# EAGLE schematic Elektrisch_schema (EAGLE 9.7.0)
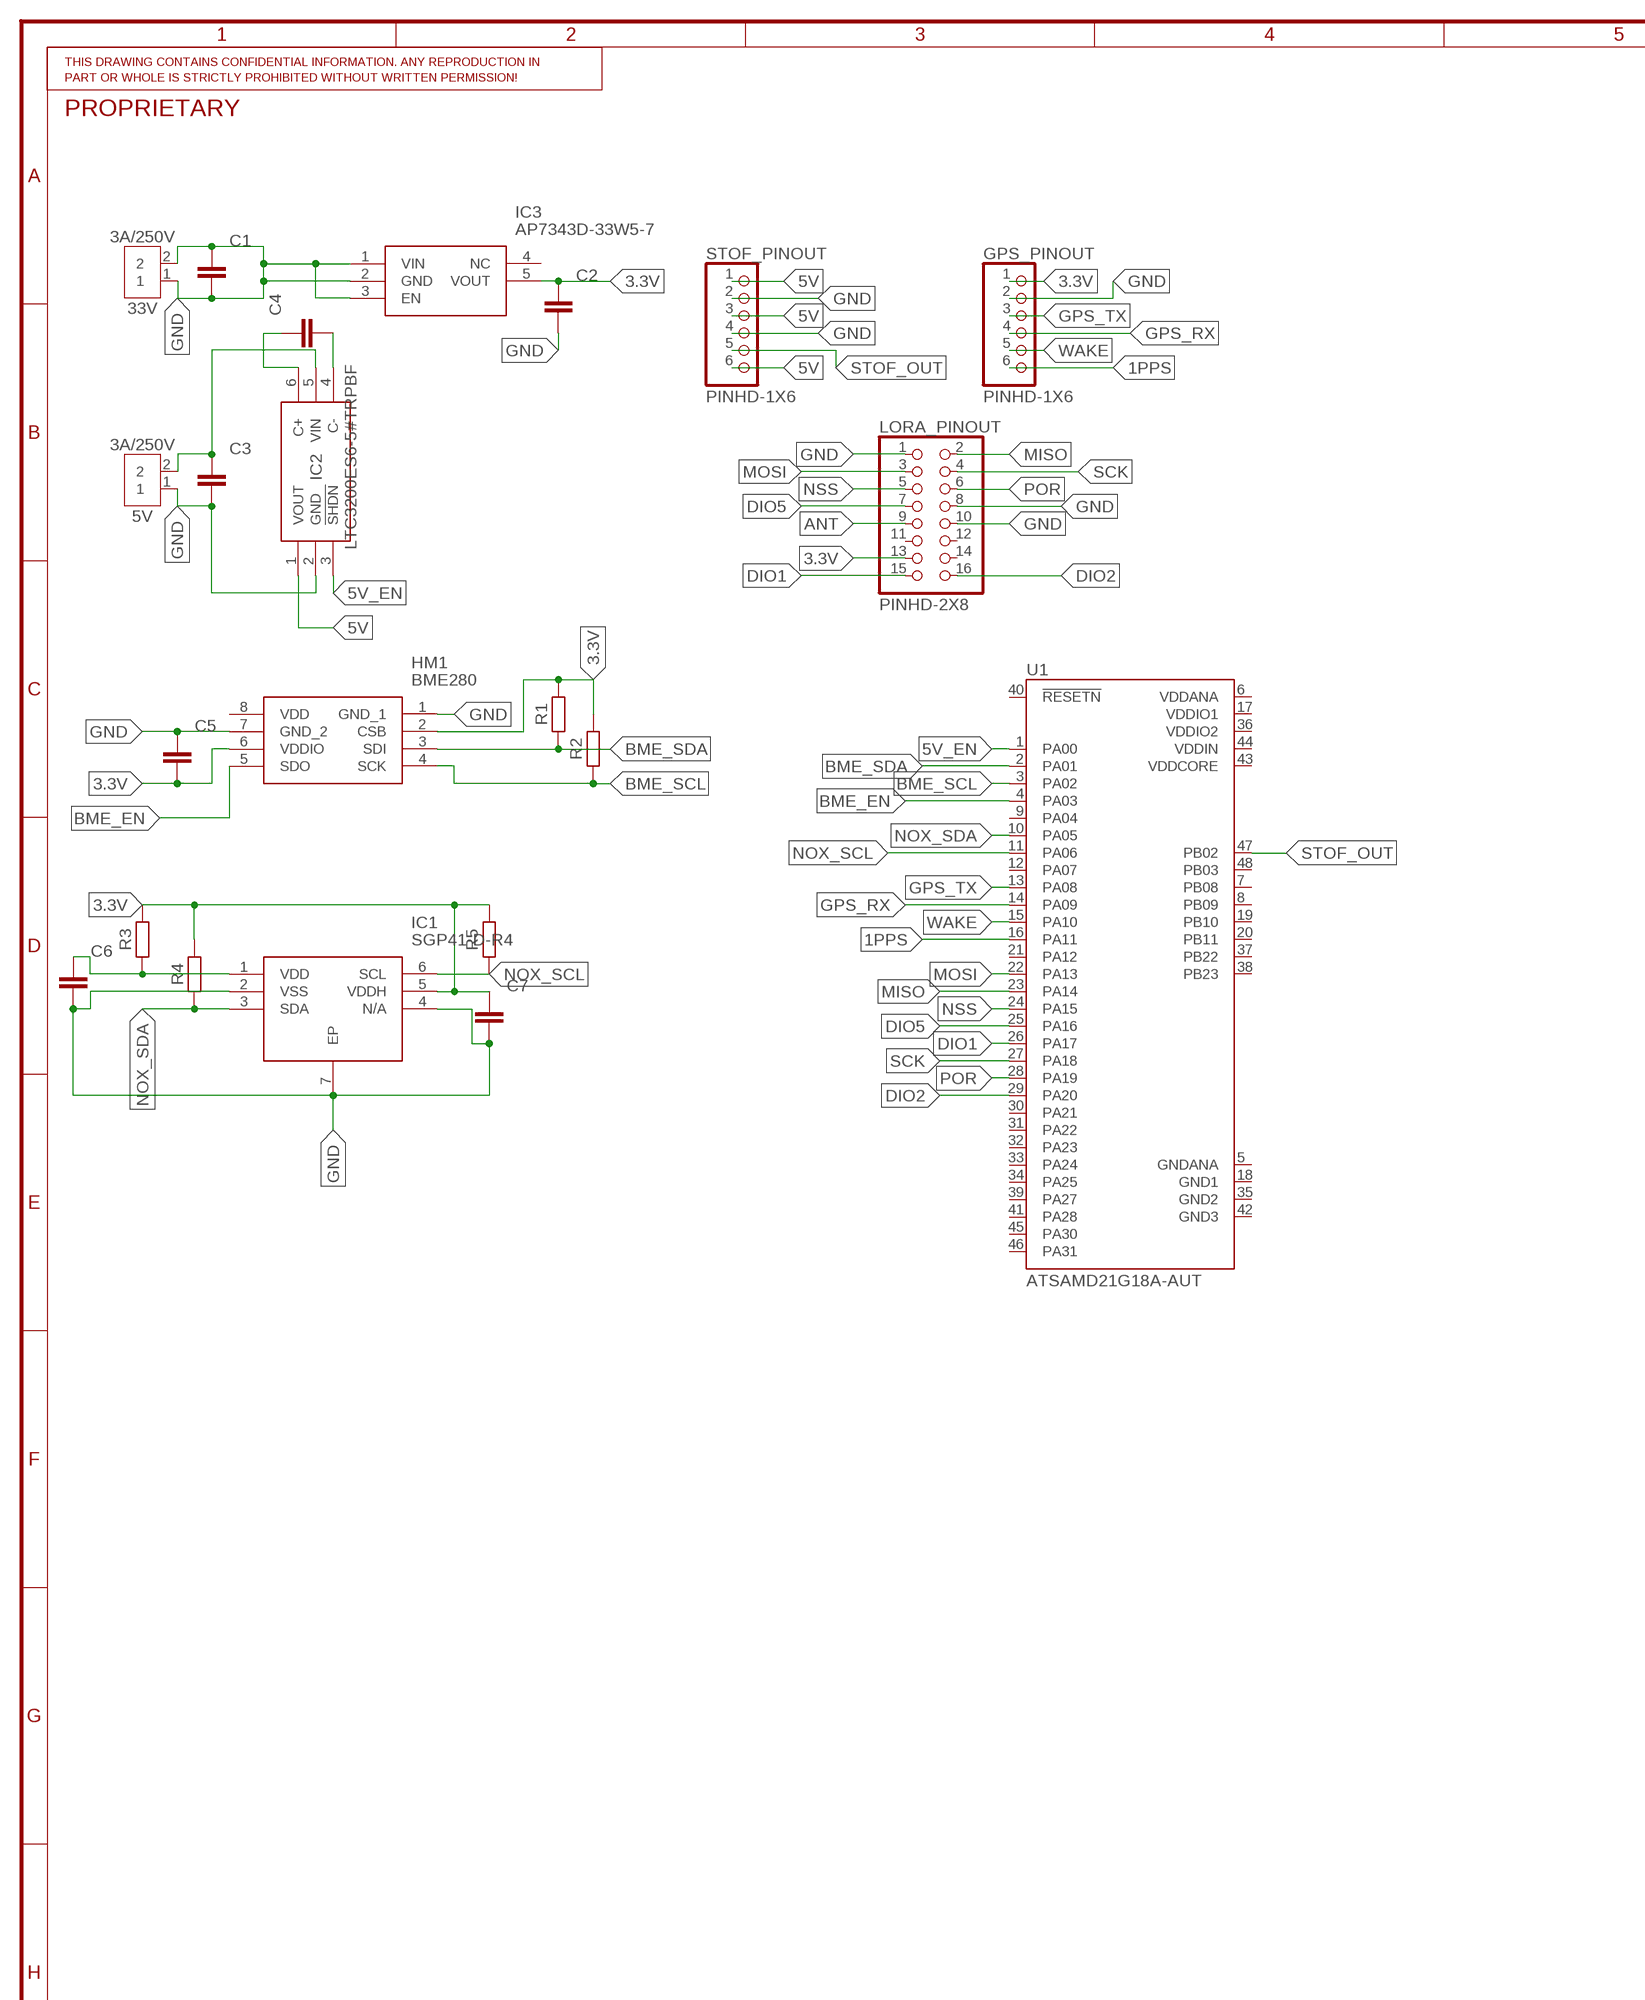
[diagram p0: schematic, sheet 1, part 1 of 2]
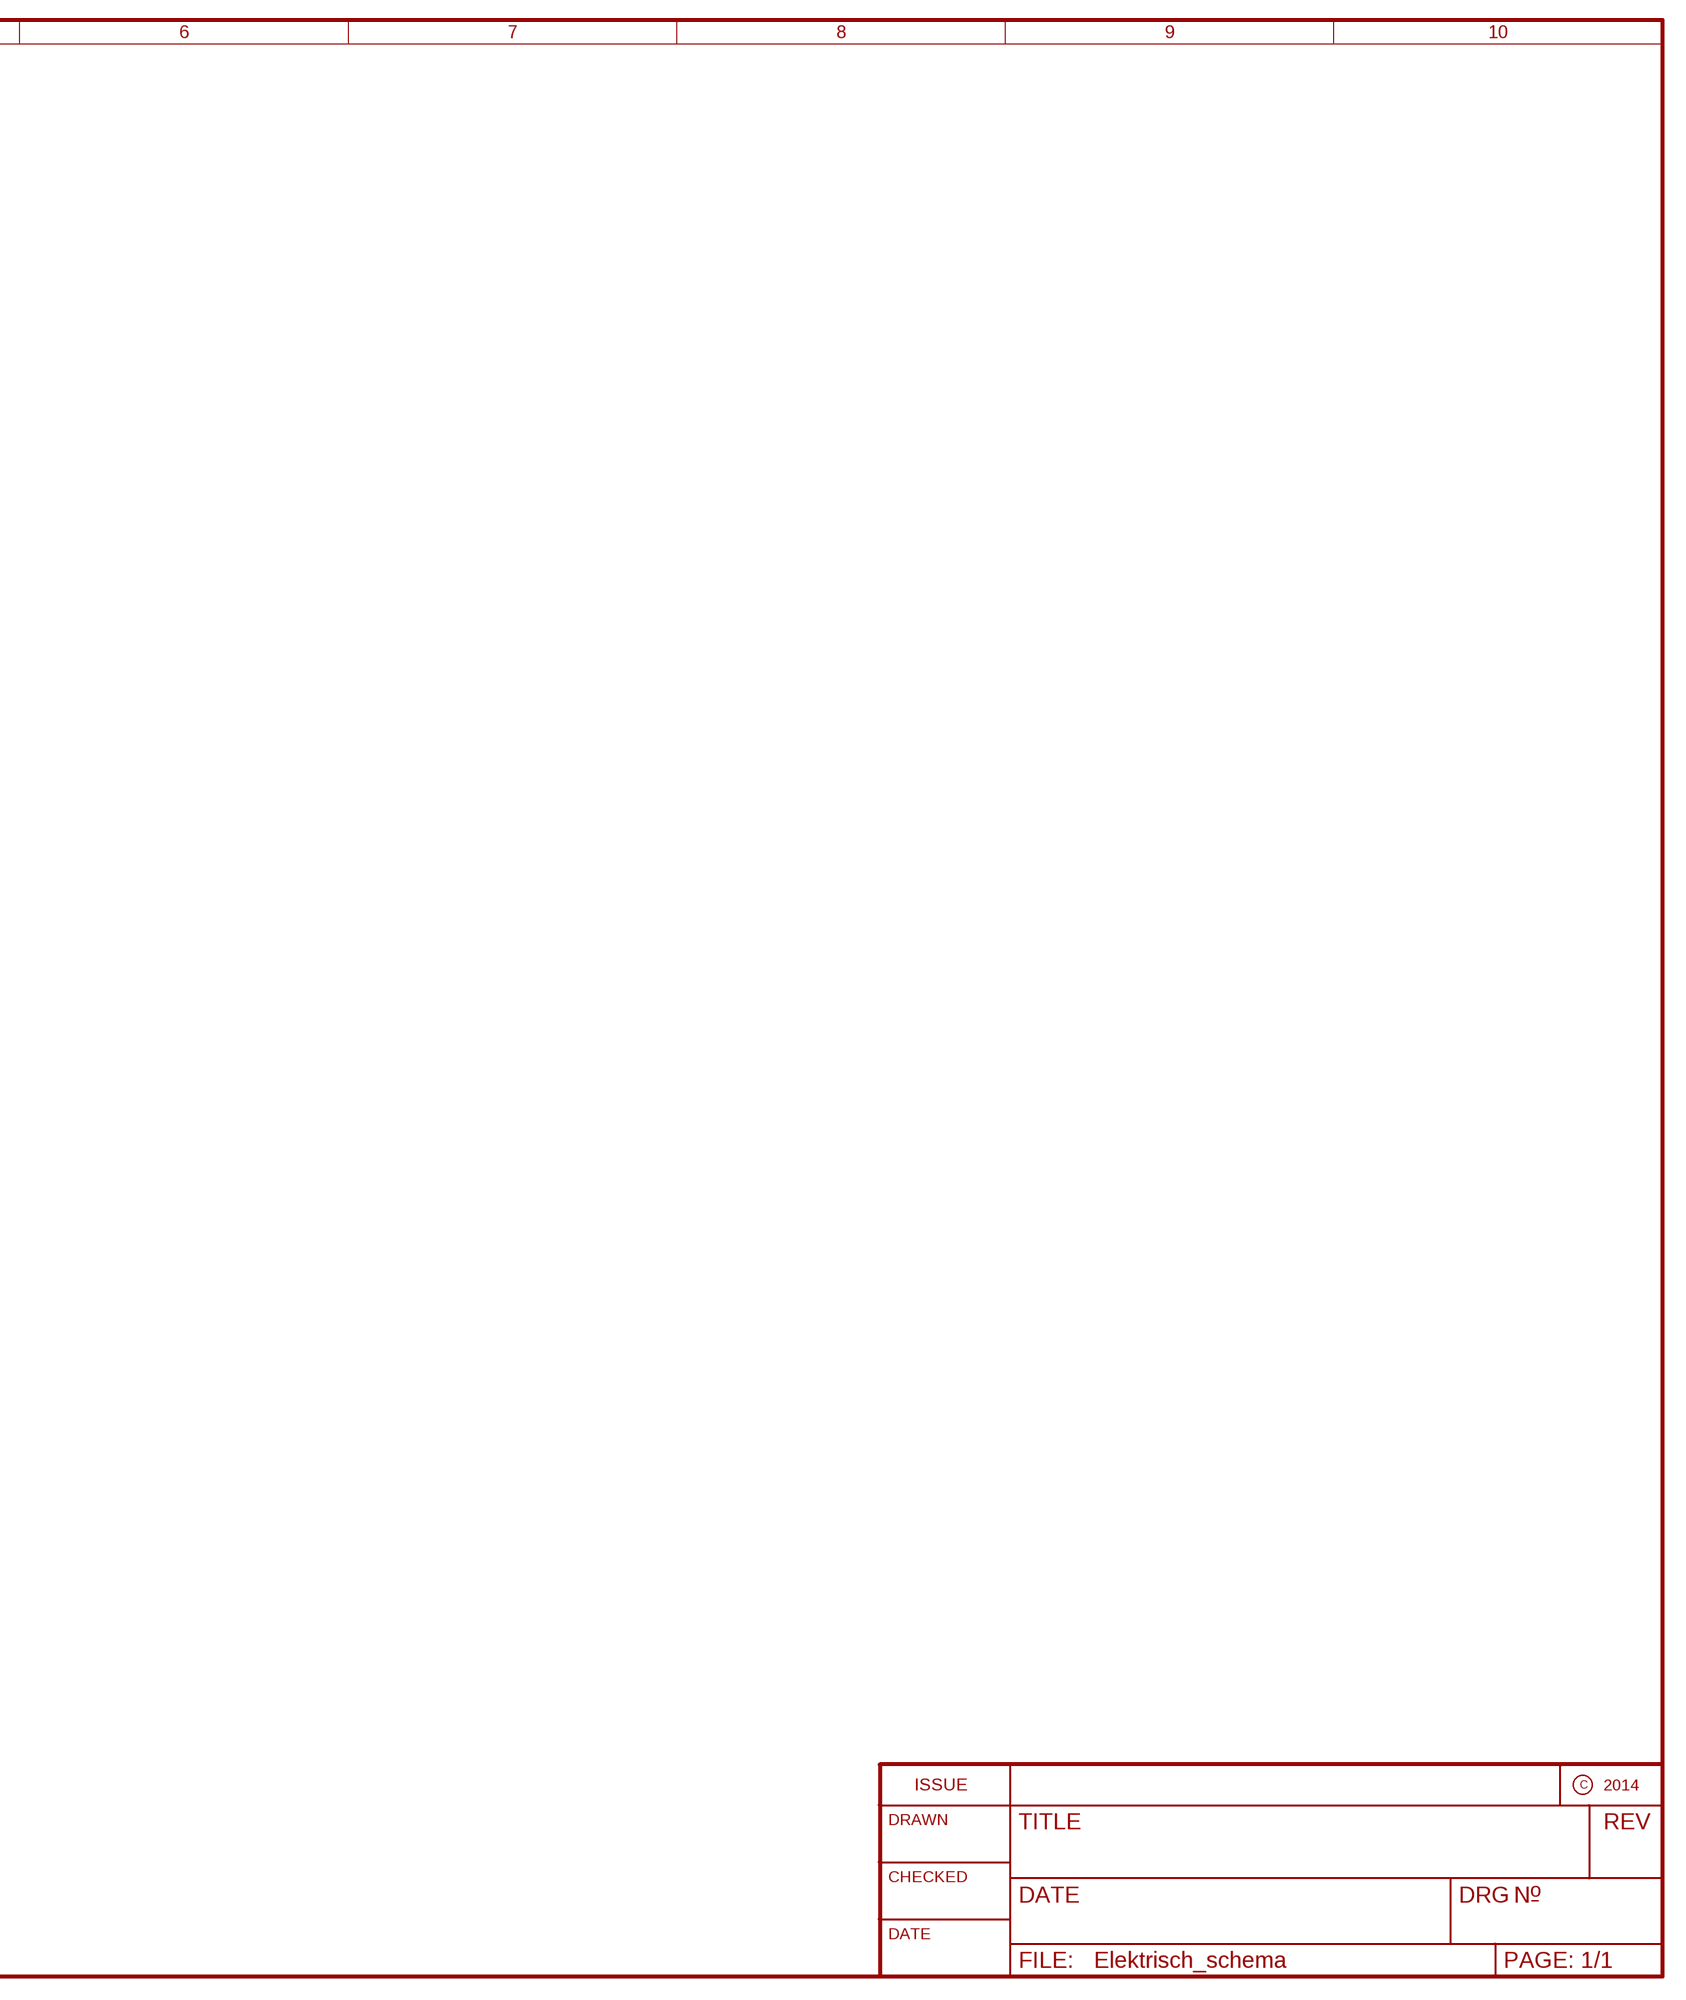
[diagram p1: schematic, sheet 1, part 2 of 2]

## Parts
5V  3A/250V  B2B-XH-A  [B2B-XH-A]
33V  3A/250V  B2B-XH-A  [B2B-XH-A]
C1  C_CHIP-0402(1005-METRIC)  [CAPC1005X60]
C2  C_CHIP-0402(1005-METRIC)  [CAPC1005X60]
C3  C_CHIP-0402(1005-METRIC)  [CAPC1005X60]
C4  C_CHIP-0402(1005-METRIC)  [CAPC1005X60]
C5  C_CHIP-0402(1005-METRIC)  [CAPC1005X60]
C6  C_CHIP-0504(1310-METRIC)  [CAPC1110X102]
C7  C_CHIP-0402(1005-METRIC)  [CAPC1005X60]
GPS_PINOUT  PINHD-1X6  [1X06]
HM1  BME280  [BME280]
IC1  SGP41-D-R4  [SON80P244X244X95-7N]
IC2  LTC3200ES6-5#TRPBF  [SOT95P280X145-6N]
IC3  AP7343D-33W5-7  [SOT95P285X140-5N]
LORA_PINOUT  PINHD-2X8  [2X08]
R1  R_CHIP-0402(1005-METRIC)  [RESC1005X40]
R2  R_CHIP-0402(1005-METRIC)  [RESC1005X40]
R3  R_CHIP-0402(1005-METRIC)  [RESC1005X40]
R4  R_CHIP-0402(1005-METRIC)  [RESC1005X40]
R5  R_CHIP-0402(1005-METRIC)  [RESC1005X40]
STOF_PINOUT  PINHD-1X6  [1X06]
U1  ATSAMD21G18A-AUT  [QFP50P900X900X120-48N]

## Nets
1PPS: GPS_PINOUT.6 U1.16(PA11)
3.3V: C2.1 C5.2 C7.1 GPS_PINOUT.1 HM1.2(CSB) HM1.6(VDDIO) IC1.5(VDDH) IC3.5(VOUT) LORA_PINOUT.13 R1.2 R2.2 R3.2 R4.2 R5.2
5V: IC2.1(VOUT) STOF_PINOUT.1 STOF_PINOUT.3 STOF_PINOUT.6
5V_EN: IC2.3(!SHDN) U1.1(PA00)
ANT: LORA_PINOUT.9
BME_EN: HM1.5(SDO) U1.4(PA03)
BME_SCL: HM1.4(SCK) R2.1 U1.3(PA02)
BME_SDA: HM1.3(SDI) R1.1 U1.2(PA01)
DIO1: LORA_PINOUT.15 U1.26(PA17)
DIO2: LORA_PINOUT.16 U1.29(PA20)
DIO5: LORA_PINOUT.7 U1.25(PA16)
GND: 5V.1 33V.2 C1.1 C1.2 C2.2 C3.2 C5.1 C6.2 C7.2 GPS_PINOUT.2 HM1.1(GND_1) HM1.7(GND_2) IC1.2(VSS) IC1.4(N/A) IC1.7(EP) IC2.2(GND) IC3.1(VIN) IC3.2(GND) IC3.3(EN) LORA_PINOUT.1 LORA_PINOUT.8 LORA_PINOUT.10 STOF_PINOUT.2 STOF_PINOUT.4
GPS_RX: GPS_PINOUT.4 U1.14(PA09)
GPS_TX: GPS_PINOUT.3 U1.13(PA08)
MISO: LORA_PINOUT.2 U1.23(PA14)
MOSI: LORA_PINOUT.3 U1.22(PA13)
N$1: 5V.2 C3.1 IC2.5(VIN)
N$2: 33V.1
N$3: C4.2 IC2.4(C-)
N$4: C4.1 IC2.6(C+)
N$5: C6.1 IC1.1(VDD) R3.1
NOX_SCL: IC1.6(SCL) R5.1 U1.11(PA06)
NOX_SDA: IC1.3(SDA) R4.1 U1.10(PA05)
NSS: LORA_PINOUT.5 U1.24(PA15)
POR: LORA_PINOUT.6 U1.28(PA19)
SCK: LORA_PINOUT.4 U1.27(PA18)
STOF_OUT: STOF_PINOUT.5 U1.47(PB02)
WAKE: GPS_PINOUT.5 U1.15(PA10)
Unconnected: IC3.4(NC) LORA_PINOUT.11 LORA_PINOUT.12 LORA_PINOUT.14 U1.7(PB08) U1.8(PB09) U1.9(PA04) U1.12(PA07) U1.19(PB10) U1.20(PB11) U1.21(PA12) U1.30(PA21) U1.31(PA22) U1.32(PA23) U1.33(PA24) U1.34(PA25) U1.37(PB22) U1.38(PB23) U1.39(PA27) U1.40(!RESETN) U1.41(PA28) U1.45(PA30) U1.46(PA31) U1.48(PB03)

## Power pins joined to a net without a drawn wire
GND1: U1.18(GND1)
GND2: U1.35(GND2)
GND3: U1.42(GND3)
GNDANA: U1.5(GNDANA)
VDD: HM1.8(VDD)
VDDANA: U1.6(VDDANA)
VDDCORE: U1.43(VDDCORE)
VDDIN: U1.44(VDDIN)
VDDIO1: U1.17(VDDIO1)
VDDIO2: U1.36(VDDIO2)

## Library data of the parts
5V 33V = Connector:B2B-XH-A: XH Connector Top Entry - 2POS Details see: Datasheet <http://www.jst-mfg.com/product/pdf/eng/eXH.pdf>; CATEGORY: CONNECTOR; DESCRIPTION: 2.5mm pitch/disconnectable crimp style connector; MANUFACTURER: JST (XH CONNECTOR); MPN: B2B-XH-A; OPERATING_TEMPERATURE: -25°C ~ 85°C; PART_STATUS: ACTIVE; ROHS_COMPLIANT: COMPLIANT; SERIES: B_B-XH-A; SUB_CATEGORY: Through hole connector; TYPE: top entry
C1-C7 = Capacitor:C: Capacitor - Generic; CATEGORY: Capacitor
GPS_PINOUT STOF_PINOUT = Connector:PINHD-1X6: PIN HEADER; CATEGORY: CONNECTOR; SUB-CATEGORY: PIN-HEADER
HM1 = BME280:BME280: Board Mount Humidity Sensors Source: Datasheet <https://datasheet.datasheetarchive.com/originals/distributors/DKDS-24/462906.pdf>; ARROW_PART_NUMBER: BME280; ARROW_PRICE-STOCK: https://www.arrow.com/en/products/bme280/bosch; DESCRIPTION: Board Mount Humidity Sensors; HEIGHT: mm; MANUFACTURER_NAME: Bosch Sensortec; MANUFACTURER_PART_NUMBER: BME280; MOUSER_PART_NUMBER: 262-BME280; MOUSER_PRICE-STOCK: https://www.mouser.co.uk/ProductDetail/Bosch-Sensortec/BME280?qs=2OnyuXx6vpj2fK9HX7qb3g%3D%3D
IC1 = SGP41-D-R4:SGP41-D-R4: Air Quality Sensors VOC and NOx (MOX) Gas Pollutant Sensor Source: Datasheet <https://www.sensirion.com/fileadmin/user_upload/customers/sensirion/Dokumente/9_Gas_Sensors/Datasheets/Sensirion_Gas_Sensors_Datasheet_SGP41.pdf>; DESCRIPTION: Air Quality Sensors VOC and NOx (MOX) Gas Pollutant Sensor; HEIGHT: 0.95mm; MANUFACTURER_NAME: Sensirion; MANUFACTURER_PART_NUMBER: SGP41-D-R4; MOUSER_PART_NUMBER: 403-SGP41-D-R4; MOUSER_PRICE-STOCK: https://www.mouser.co.uk/ProductDetail/Sensirion/SGP41-D-R4?qs=A6eO%252BMLsxmRqwfOE5NYPVA%3D%3D
IC2 = LTC3200ES6-5#TRPBF:LTC3200ES6-5#TRPBF: Switching Voltage Regulators 100mA Low Noise Charge Pump Source: Datasheet <https://nl.mouser.com/datasheet/2/609/32005f-1269814.pdf>; ARROW_PART_NUMBER: LTC3200ES6-5#TRPBF; ARROW_PRICE-STOCK: https://www.arrow.com/en/products/ltc3200es6-5trpbf/analog-devices?region=nac; DESCRIPTION: Switching Voltage Regulators 100mA Low Noise Charge Pump; HEIGHT: 1.45mm; MANUFACTURER_NAME: Analog Devices; MANUFACTURER_PART_NUMBER: LTC3200ES6-5#TRPBF; MOUSER_PART_NUMBER: 584-C3200ES6-5TRPBF; MOUSER_PRICE-STOCK: https://www.mouser.co.uk/ProductDetail/Analog-Devices/LTC3200ES6-5TRPBF?qs=hVkxg5c3xu8FsASPkjrjjA%3D%3D
IC3 = AP7343D-33W5-7:AP7343D-33W5-7: DiodesZetex AP7343D-33W5-7, LDO Regulator, 300mA, 3.3 V, +/-1%, 1.7 5.25 Vin, SOT-25 5-Pin Source: Datasheet <https://componentsearchengine.com/Datasheets/1/AP7343D-33W5-7.pdf>; ARROW_PART_NUMBER: AP7343D-33W5-7; ARROW_PRICE-STOCK: https://www.arrow.com/en/products/ap7343d-33w5-7/diodes-incorporated; DESCRIPTION: DiodesZetex AP7343D-33W5-7, LDO Regulator, 300mA, 3.3 V, +/-1%, 1.7 5.25 Vin, SOT-25 5-Pin; HEIGHT: 1.4mm; MANUFACTURER_NAME: Diodes Inc.; MANUFACTURER_PART_NUMBER: AP7343D-33W5-7; MOUSER_PART_NUMBER: 621-AP7343D-33W5-7; MOUSER_PRICE-STOCK: https://www.mouser.com/Search/Refine.aspx?Keyword=621-AP7343D-33W5-7
LORA_PINOUT = Connector:PINHD-2X8: PIN HEADER; CATEGORY: CONNECTOR; SUB-CATEGORY: PIN-HEADER
R1-R5 = Resistor:R: Resistor Fixed - Generic; CATEGORY: Resistor; SUB-CATEGORY: Fixed
U1 = ATSAMD21G18A-AUT:ATSAMD21G18A-AUT: Cortex-M0+, 256KB FLASH, 32KB SRAM, USB, DMA, T&R - 48TQFP IND TEMP, GREEN, 1.6-3.6V, 48MHz; MANUFACTURER: ATMEL